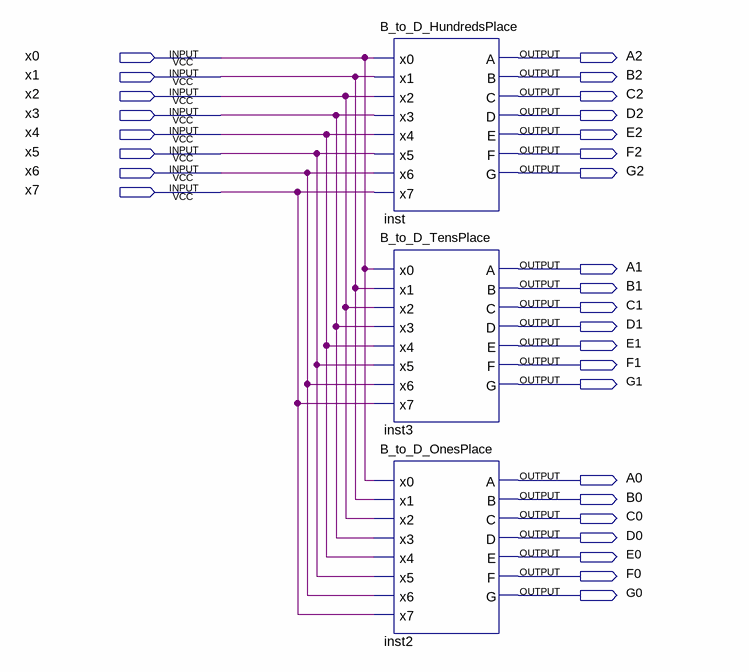
[diagram p0: schematic sheet]
// Quartus schematic B_to_D.bdf as structural Verilog: 3 symbols, 29 pins
module B_to_D (
  input  x0,
  input  x1,
  input  x2,
  input  x3,
  input  x4,
  input  x5,
  input  x6,
  input  x7,
  output A2,
  output B2,
  output C2,
  output D2,
  output E2,
  output F2,
  output G2,
  output A1,
  output B1,
  output C1,
  output D1,
  output E1,
  output F1,
  output G1,
  output A0,
  output B0,
  output C0,
  output D0,
  output E0,
  output F0,
  output G0
);

  B_to_D_HundredsPlace inst (
    .x0(x0), .x1(x1), .x2(x2), .x3(x3), .x4(x4), .x5(x5), .x6(x6), .x7(x7), .A(A2), .B(B2), .C(C2), .D(D2),
    .E(E2), .F(F2), .G(G2));
  B_to_D_TensPlace inst3 (
    .x0(x0), .x1(x1), .x2(x2), .x3(x3), .x4(x4), .x5(x5), .x6(x6), .x7(x7), .A(A1), .B(B1), .C(C1), .D(D1),
    .E(E1), .F(F1), .G(G1));
  B_to_D_OnesPlace inst2 (
    .x0(x0), .x1(x1), .x2(x2), .x3(x3), .x4(x4), .x5(x5), .x6(x6), .x7(x7), .A(A0), .B(B0), .C(C0), .D(D0),
    .E(E0), .F(F0), .G(G0));
endmodule
